# Altium schematic sheet TwoMotor.SchDoc
size A4
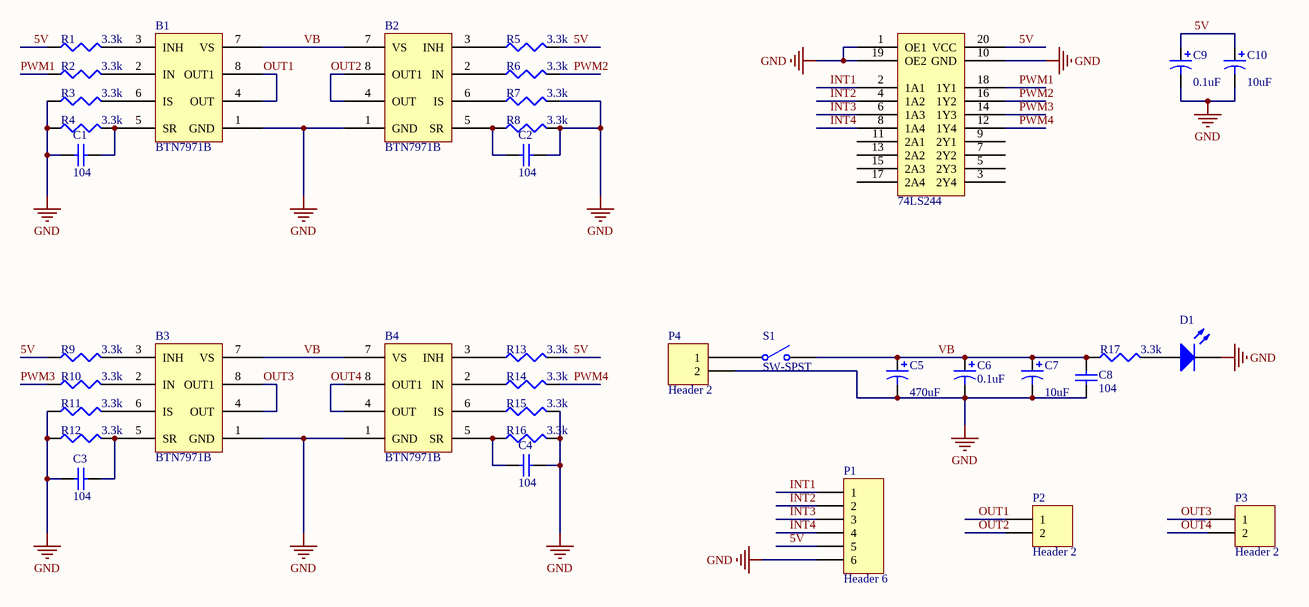
[diagram p0: TwoMotor.SchDoc]

## Parts
B1  BTN7971B  [BTN7971B]
B2  BTN7971B  [BTN7971B]
B3  BTN7971B  [BTN7971B]
B4  BTN7971B  [BTN7971B]
C1  value 104  [C0805]  (hidden comment: Cap Chip 0805)
C2  value 104  [C0805]  (hidden comment: Cap Chip 0805)
C3  value 104  [C0805]  (hidden comment: Cap Chip 0805)
C4  value 104  [C0805]  (hidden comment: Cap Chip 0805)
C5  value 470uF  [CAPPR5-8X11.5]  (hidden comment: Cap Pol3)
C6  value 0.1uF  [C3216]  (hidden comment: Cap Pol3)
C7  value 10uF  [C6032]  (hidden comment: Cap Pol3)
C8  value 104  [C0805]  (hidden comment: Cap Chip 0805)
C9  value 0.1uF  [C3216]  (hidden comment: Cap Pol3)
C10  value 10uF  [C6032]  (hidden comment: Cap Pol3)
D1  LED2  [C1206]  (value not drawn)
P1  Header 6  [HDR1X6]
P2  Header 2  [2PIN-5.08B]
P3  Header 2  [2PIN-5.08B]
P4  Header 2  [2PIN-5.08B]
R1  value 3.3k  [R0805]  (hidden comment: Res3)
R2  value 3.3k  [R0805]  (hidden comment: Res3)
R3  value 3.3k  [R0805]  (hidden comment: Res3)
R4  value 3.3k  [R0805]  (hidden comment: Res3)
R5  value 3.3k  [R0805]  (hidden comment: Res3)
R6  value 3.3k  [R0805]  (hidden comment: Res3)
R7  value 3.3k  [R0805]  (hidden comment: Res3)
R8  value 3.3k  [R0805]  (hidden comment: Res3)
R9  value 3.3k  [R0805]  (hidden comment: Res3)
R10  value 3.3k  [R0805]  (hidden comment: Res3)
R11  value 3.3k  [R0805]  (hidden comment: Res3)
R12  value 3.3k  [R0805]  (hidden comment: Res3)
R13  value 3.3k  [R0805]  (hidden comment: Res3)
R14  value 3.3k  [R0805]  (hidden comment: Res3)
R15  value 3.3k  [R0805]  (hidden comment: Res3)
R16  value 3.3k  [R0805]  (hidden comment: Res3)
R17  value 3.3k  [R0805]  (hidden comment: Res3)
S1  SW-SPST  [SW-TO3]
Z1  74LS244  [SOP20_M]

## Nets
GND: B1.1(GND) B2.1(GND) B3.1(GND) B4.1(GND) C1.1 C2.2 C3.1 C4.2 C5.2 C6.2 C7.2 C8.1 C9.2 C10.2 D1.2(K) P1.6 P4.2 R3.1 R4.1 R7.2 R8.2 R11.1 R12.1 R15.2 R16.2 Z1.1(OE1) Z1.10(GND) Z1.19(OE2)
5V: C9.1 C10.1 P1.5 R1.1 R5.2 R9.1 R13.2 Z1.20(VCC)
INT1: P1.1 Z1.2(1A1)
INT2: P1.2 Z1.4(1A2)
INT3: P1.3 Z1.6(1A3)
INT4: P1.4 Z1.8(1A4)
OUT1: B1.4(OUT) B1.8(OUT1) P2.1
OUT2: B2.4(OUT) B2.8(OUT1) P2.2
OUT3: B3.4(OUT) B3.8(OUT1) P3.1
OUT4: B4.4(OUT) B4.8(OUT1) P3.2
PWM1: R2.1 Z1.18(1Y1)
PWM2: R6.2 Z1.16(1Y2)
PWM3: R10.1 Z1.14(1Y3)
PWM4: R14.2 Z1.12(1Y4)
VB: B1.7(VS) B2.7(VS) B3.7(VS) B4.7(VS) C5.1 C6.1 C7.1 C8.2 R17.1 S1.2(NO)
NetB1_2: B1.2(IN) R2.2
NetB1_3: B1.3(INH) R1.2
NetB1_5: B1.5(SR) C1.2 R4.2
NetB1_6: B1.6(IS) R3.2
NetB2_2: B2.2(IN) R6.1
NetB2_3: B2.3(INH) R5.1
NetB2_5: B2.5(SR) C2.1 R8.1
NetB2_6: B2.6(IS) R7.1
NetB3_2: B3.2(IN) R10.2
NetB3_3: B3.3(INH) R9.2
NetB3_5: B3.5(SR) C3.2 R12.2
NetB3_6: B3.6(IS) R11.2
NetB4_2: B4.2(IN) R14.1
NetB4_3: B4.3(INH) R13.1
NetB4_5: B4.5(SR) C4.1 R16.1
NetB4_6: B4.6(IS) R15.1
NetD1_1: D1.1(A) R17.2
NetP4_1: P4.1 S1.1(COMMON)

Not connected (* = marked no-connect by the designer): Z1 3(2Y4) 5(2Y3) 7(2Y2) 9(2Y1) 11(2A1) 13(2A2) 15(2A3) 17(2A4)

## Library data of the parts
C1-C4 C8 = Cap Chip 0805: Polarized Capacitor (Radial); Published: 8-Jun-2000; Revision: July-2002: Re-released for DXP Platform.; Publisher: Altium Limited
C5-C7 C9 C10 = Cap Pol3: Polarized Capacitor (Surface Mount); Published: 8-Jun-2000; LatestRevisionDate: 29-May-2009; LatestRevisionNote: IPC-7351 Footprint Added.; PackageReference: C0805; Publisher: Altium Limited; PackageDescription: Chip Capacitor
D1 = LED2: Typical RED, GREEN, YELLOW, AMBER GaAs LED; Published: 8-Jun-2000; LatestRevisionDate: 17-Jul-2002; LatestRevisionNote: Re-released for DXP Platform.; PackageVersion: Feb-2002; PackageReference: 3.2X1.6X1.1; Publisher: Altium Limited; PackageDescription: SM LED; 2 Flat Leads
P1 = Header 6: Header, 6-Pin; LatestRevisionDate: 17-Jul-2002; LatestRevisionNote: Re-released for DXP Platform.; Publisher: Altium Limited
P2-P4 = Header 2: Header, 2-Pin; LatestRevisionDate: 17-Jul-2002; LatestRevisionNote: Re-released for DXP Platform.; Publisher: Altium Limited
R1-R17 = Res3: Resistor; Published: 8-Jun-2000; LatestRevisionDate: 29-May-2009; LatestRevisionNote: IPC-7351 Footprint Added.; PackageReference: J1-0603; Publisher: Altium Limited; PackageDescription: Chip Resistor
S1 = SW-SPST: Single-Pole, Single-Throw Switch; Published: 24-Mar-1999; Revision: July-2002: Re-released for DXP Platform.; Publisher: Altium Limited
Z1 = 74LS244: SOP-20